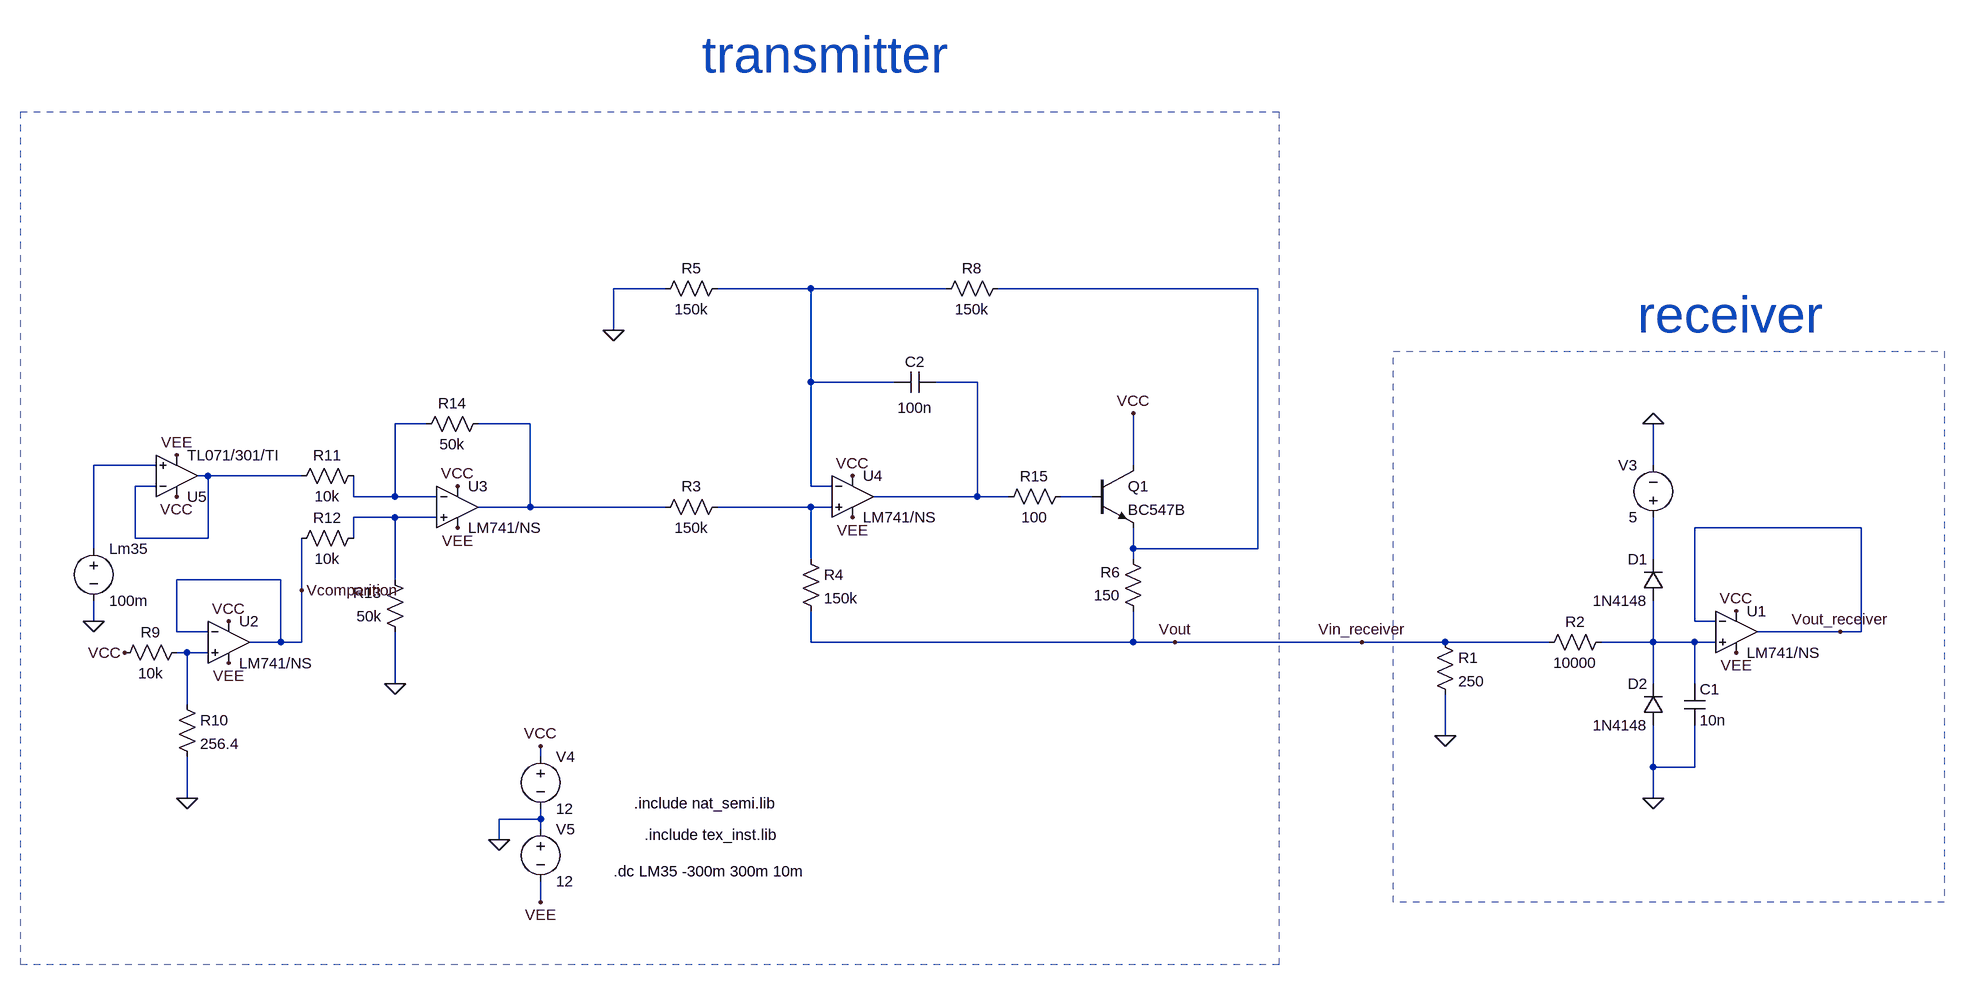
[diagram p0: schematic comunication_ltspice.asc]
comunication_ltspice.asc, the LTspice schematic file:
Version 4
SHEET 1 1520 744
WIRE -1456 -416 -1536 -416
WIRE -1232 -416 -1376 -416
WIRE -1024 -416 -1232 -416
WIRE -544 -416 -944 -416
WIRE -1536 -352 -1536 -416
WIRE -1232 -272 -1232 -416
WIRE -1104 -272 -1232 -272
WIRE -976 -272 -1040 -272
WIRE -1824 -208 -1872 -208
WIRE -1664 -208 -1744 -208
WIRE -2240 -144 -2336 -144
WIRE -736 -144 -736 -224
WIRE 64 -144 64 -208
WIRE -2160 -128 -2176 -128
WIRE -2016 -128 -2160 -128
WIRE -2240 -112 -2272 -112
WIRE -1232 -112 -1232 -272
WIRE -1200 -112 -1232 -112
WIRE -1936 -96 -1936 -128
WIRE -1872 -96 -1872 -208
WIRE -1872 -96 -1936 -96
WIRE -1808 -96 -1872 -96
WIRE -976 -96 -976 -272
WIRE -976 -96 -1136 -96
WIRE -928 -96 -976 -96
WIRE -800 -96 -848 -96
WIRE -1664 -80 -1664 -208
WIRE -1664 -80 -1744 -80
WIRE -1456 -80 -1664 -80
WIRE -1232 -80 -1376 -80
WIRE -1200 -80 -1232 -80
WIRE -1872 -64 -1936 -64
WIRE -1808 -64 -1872 -64
WIRE 384 -48 128 -48
WIRE -2272 -32 -2272 -112
WIRE -2160 -32 -2160 -128
WIRE -2160 -32 -2272 -32
WIRE -1936 -32 -1936 -64
WIRE -2336 -16 -2336 -144
WIRE -736 -16 -736 -48
WIRE -544 -16 -544 -416
WIRE -544 -16 -736 -16
WIRE -1232 0 -1232 -80
WIRE -736 0 -736 -16
WIRE 64 0 64 -64
WIRE -2048 32 -2208 32
WIRE -1872 32 -1872 -64
WIRE -2016 48 -2016 -32
WIRE -2336 96 -2336 64
WIRE 128 96 128 -48
WIRE 160 96 128 96
WIRE -2208 112 -2208 32
WIRE -2160 112 -2208 112
WIRE 352 112 224 112
WIRE 384 112 384 -48
WIRE 384 112 352 112
WIRE -2048 128 -2048 32
WIRE -2048 128 -2096 128
WIRE -2016 128 -2016 48
WIRE -2016 128 -2048 128
WIRE -1232 128 -1232 80
WIRE -736 128 -736 80
WIRE -736 128 -1232 128
WIRE -672 128 -736 128
WIRE -384 128 -672 128
WIRE -256 128 -384 128
WIRE -96 128 -256 128
WIRE 64 128 64 64
WIRE 64 128 -16 128
WIRE 128 128 64 128
WIRE 160 128 128 128
WIRE -2192 144 -2208 144
WIRE -2160 144 -2192 144
WIRE -1872 192 -1872 112
WIRE 64 192 64 128
WIRE 128 192 128 128
WIRE -2192 224 -2192 144
WIRE -256 272 -256 208
WIRE -1648 304 -1648 288
WIRE 64 320 64 256
WIRE 128 320 128 256
WIRE 128 320 64 320
WIRE -2192 368 -2192 304
WIRE 64 368 64 320
WIRE -1648 400 -1648 384
WIRE -1648 400 -1712 400
WIRE -1648 416 -1648 400
WIRE -1712 432 -1712 400
WIRE -1648 528 -1648 496
FLAG 192 144 VEE
FLAG 192 80 VCC
FLAG 64 368 0
FLAG 64 -208 0
FLAG -1648 288 VCC
FLAG -1648 528 VEE
FLAG -1712 432 0
FLAG -1168 -64 VEE
FLAG -1168 -128 VCC
FLAG -1536 -352 0
FLAG -736 -224 VCC
FLAG -2336 96 0
FLAG -2128 160 VEE
FLAG -2128 96 VCC
FLAG -672 128 Vout
FLAG -1776 -48 VEE
FLAG -1776 -112 VCC
FLAG -2192 368 0
FLAG -2208 -96 VCC
FLAG -2208 -160 VEE
FLAG -2288 144 VCC
FLAG -1872 192 0
FLAG -2016 48 Vcomparition
FLAG -256 272 0
FLAG -384 128 Vin_receiver
FLAG 352 112 Vout_receiver
SYMBOL Opamps\\opamp2 192 48 R0
SYMATTR InstName U1
SYMATTR Value LM741/NS
SYMBOL res -272 112 R0
SYMATTR InstName R1
SYMATTR Value 250
SYMBOL res 0 112 R90
WINDOW 0 0 56 VBottom 2
WINDOW 3 32 56 VTop 2
SYMATTR InstName R2
SYMATTR Value 10000
SYMBOL cap 112 192 R0
SYMATTR InstName C1
SYMATTR Value 10n
SYMBOL diode 80 64 R180
WINDOW 0 24 64 Left 2
WINDOW 3 24 0 Left 2
SYMATTR InstName D1
SYMATTR Value 1N4148
SYMBOL diode 80 256 R180
WINDOW 0 24 64 Left 2
WINDOW 3 24 0 Left 2
SYMATTR InstName D2
SYMATTR Value 1N4148
SYMBOL voltage 64 -48 R180
WINDOW 0 24 96 Left 2
WINDOW 3 24 16 Left 2
WINDOW 123 0 0 Left 0
WINDOW 39 0 0 Left 0
SYMATTR InstName V3
SYMATTR Value 5
SYMBOL res -1472 -64 R270
WINDOW 0 32 56 VTop 2
WINDOW 3 0 56 VBottom 2
SYMATTR InstName R3
SYMATTR Value 150k
SYMBOL voltage -1648 288 R0
SYMATTR InstName V4
SYMATTR Value 12
SYMBOL voltage -1648 400 R0
SYMATTR InstName V5
SYMATTR Value 12
SYMBOL res -1248 -16 R0
SYMATTR InstName R4
SYMATTR Value 150k
SYMBOL res -1360 -432 R90
WINDOW 0 0 56 VBottom 2
WINDOW 3 32 56 VTop 2
SYMATTR InstName R5
SYMATTR Value 150k
SYMBOL res -720 96 R180
WINDOW 0 36 76 Left 2
WINDOW 3 36 40 Left 2
SYMATTR InstName R6
SYMATTR Value 150
SYMBOL res -1040 -400 R270
WINDOW 0 32 56 VTop 2
WINDOW 3 0 56 VBottom 2
SYMATTR InstName R8
SYMATTR Value 150k
SYMBOL cap -1040 -288 R90
WINDOW 0 0 32 VBottom 2
WINDOW 3 40 32 VTop 2
SYMATTR InstName C2
SYMATTR Value 100n
SYMBOL res -2304 160 R270
WINDOW 0 32 56 VTop 2
WINDOW 3 0 56 VBottom 2
SYMATTR InstName R9
SYMATTR Value 10k
SYMBOL res -2208 208 R0
SYMATTR InstName R10
SYMATTR Value 256.4
SYMBOL res -1920 -144 R90
WINDOW 0 0 56 VBottom 2
WINDOW 3 32 56 VTop 2
SYMATTR InstName R11
SYMATTR Value 10k
SYMBOL res -1920 -48 R90
WINDOW 0 0 56 VBottom 2
WINDOW 3 32 56 VTop 2
SYMATTR InstName R12
SYMATTR Value 10k
SYMBOL res -1856 128 R180
WINDOW 0 36 76 Left 2
WINDOW 3 36 40 Left 2
SYMATTR InstName R13
SYMATTR Value 50k
SYMBOL res -1840 -192 R270
WINDOW 0 32 56 VTop 2
WINDOW 3 0 56 VBottom 2
SYMATTR InstName R14
SYMATTR Value 50k
SYMBOL res -832 -112 R90
WINDOW 0 0 56 VBottom 2
WINDOW 3 32 56 VTop 2
SYMATTR InstName R15
SYMATTR Value 100
SYMBOL npn -800 -144 R0
SYMATTR InstName Q1
SYMATTR Value BC547B
SYMBOL voltage -2336 -32 R0
SYMATTR InstName Lm35
SYMATTR Value 100m
SYMBOL Opamps\\opamp2 -2128 64 R0
SYMATTR InstName U2
SYMATTR Value LM741/NS
SYMBOL Opamps\\opamp2 -1776 -144 R0
SYMATTR InstName U3
SYMATTR Value LM741/NS
SYMBOL Opamps\\opamp2 -1168 -160 R0
SYMATTR InstName U4
SYMATTR Value LM741/NS
SYMBOL Opamps\\opamp2 -2208 -64 M180
SYMATTR InstName U5
SYMATTR Value TL071/301/TI
TEXT -1504 376 Left 2 !.include nat_semi.lib
TEXT -1488 424 Left 2 !.include tex_inst.lib
TEXT -1536 480 Left 2 !.dc LM35 -300m 300m 10m
TEXT 40 -376 Left 6 ;receiver
TEXT -1400 -776 Left 6 ;transmitter
RECTANGLE Normal -512 624 -2448 -688 2
RECTANGLE Normal 512 528 -336 -320 2

The netlist it stands for:
* comunication_ltspice.asc
XU1 N012 Vout_receiver VCC VEE Vout_receiver LM741/NS  ; pins In+ In- V+ V- OUT
R1 Vin_receiver 0 250
R2 N012 Vin_receiver 10000
C1 N012 0 10n
D1 N012 N011 1N4148
D2 0 N012 1N4148
V3 N011 0 5
R3 N005 N009 150k
V4 VCC 0 12
V5 0 VEE 12
R4 N009 Vin_receiver 150k
R5 N001 0 150k
R6 Vin_receiver N002 150
R8 N001 N002 150k
C2 N003 N001 100n
R9 VCC N013 10k
R10 N013 0 256.4
R11 N004 N007 10k
R12 N010 Vcomparition 10k
R13 0 N010 50k
R14 N004 N005 50k
R15 N008 N003 100
Q1 VCC N008 N002 0 BC547B
V§Lm35 N006 0 100m
XU2 N013 Vcomparition VCC VEE Vcomparition LM741/NS  ; pins In+ In- V+ V- OUT
XU3 N010 N004 VCC VEE N005 LM741/NS  ; pins In+ In- V+ V- OUT
XU4 N009 N001 VCC VEE N003 LM741/NS  ; pins In+ In- V+ V- OUT
XU5 N006 N007 VCC VEE N007 TL071/301/TI  ; pins In+ In- V+ V- OUT
.model D D
.lib standard.dio
.model NPN NPN
.model PNP PNP
.lib standard.bjt
.include nat_semi.lib
.include tex_inst.lib
.dc LM35 -300m 300m 10m
* receiver
* transmitter
.backanno
.end